# Altium project SensorControl_Board_v3.1.PrjPcb
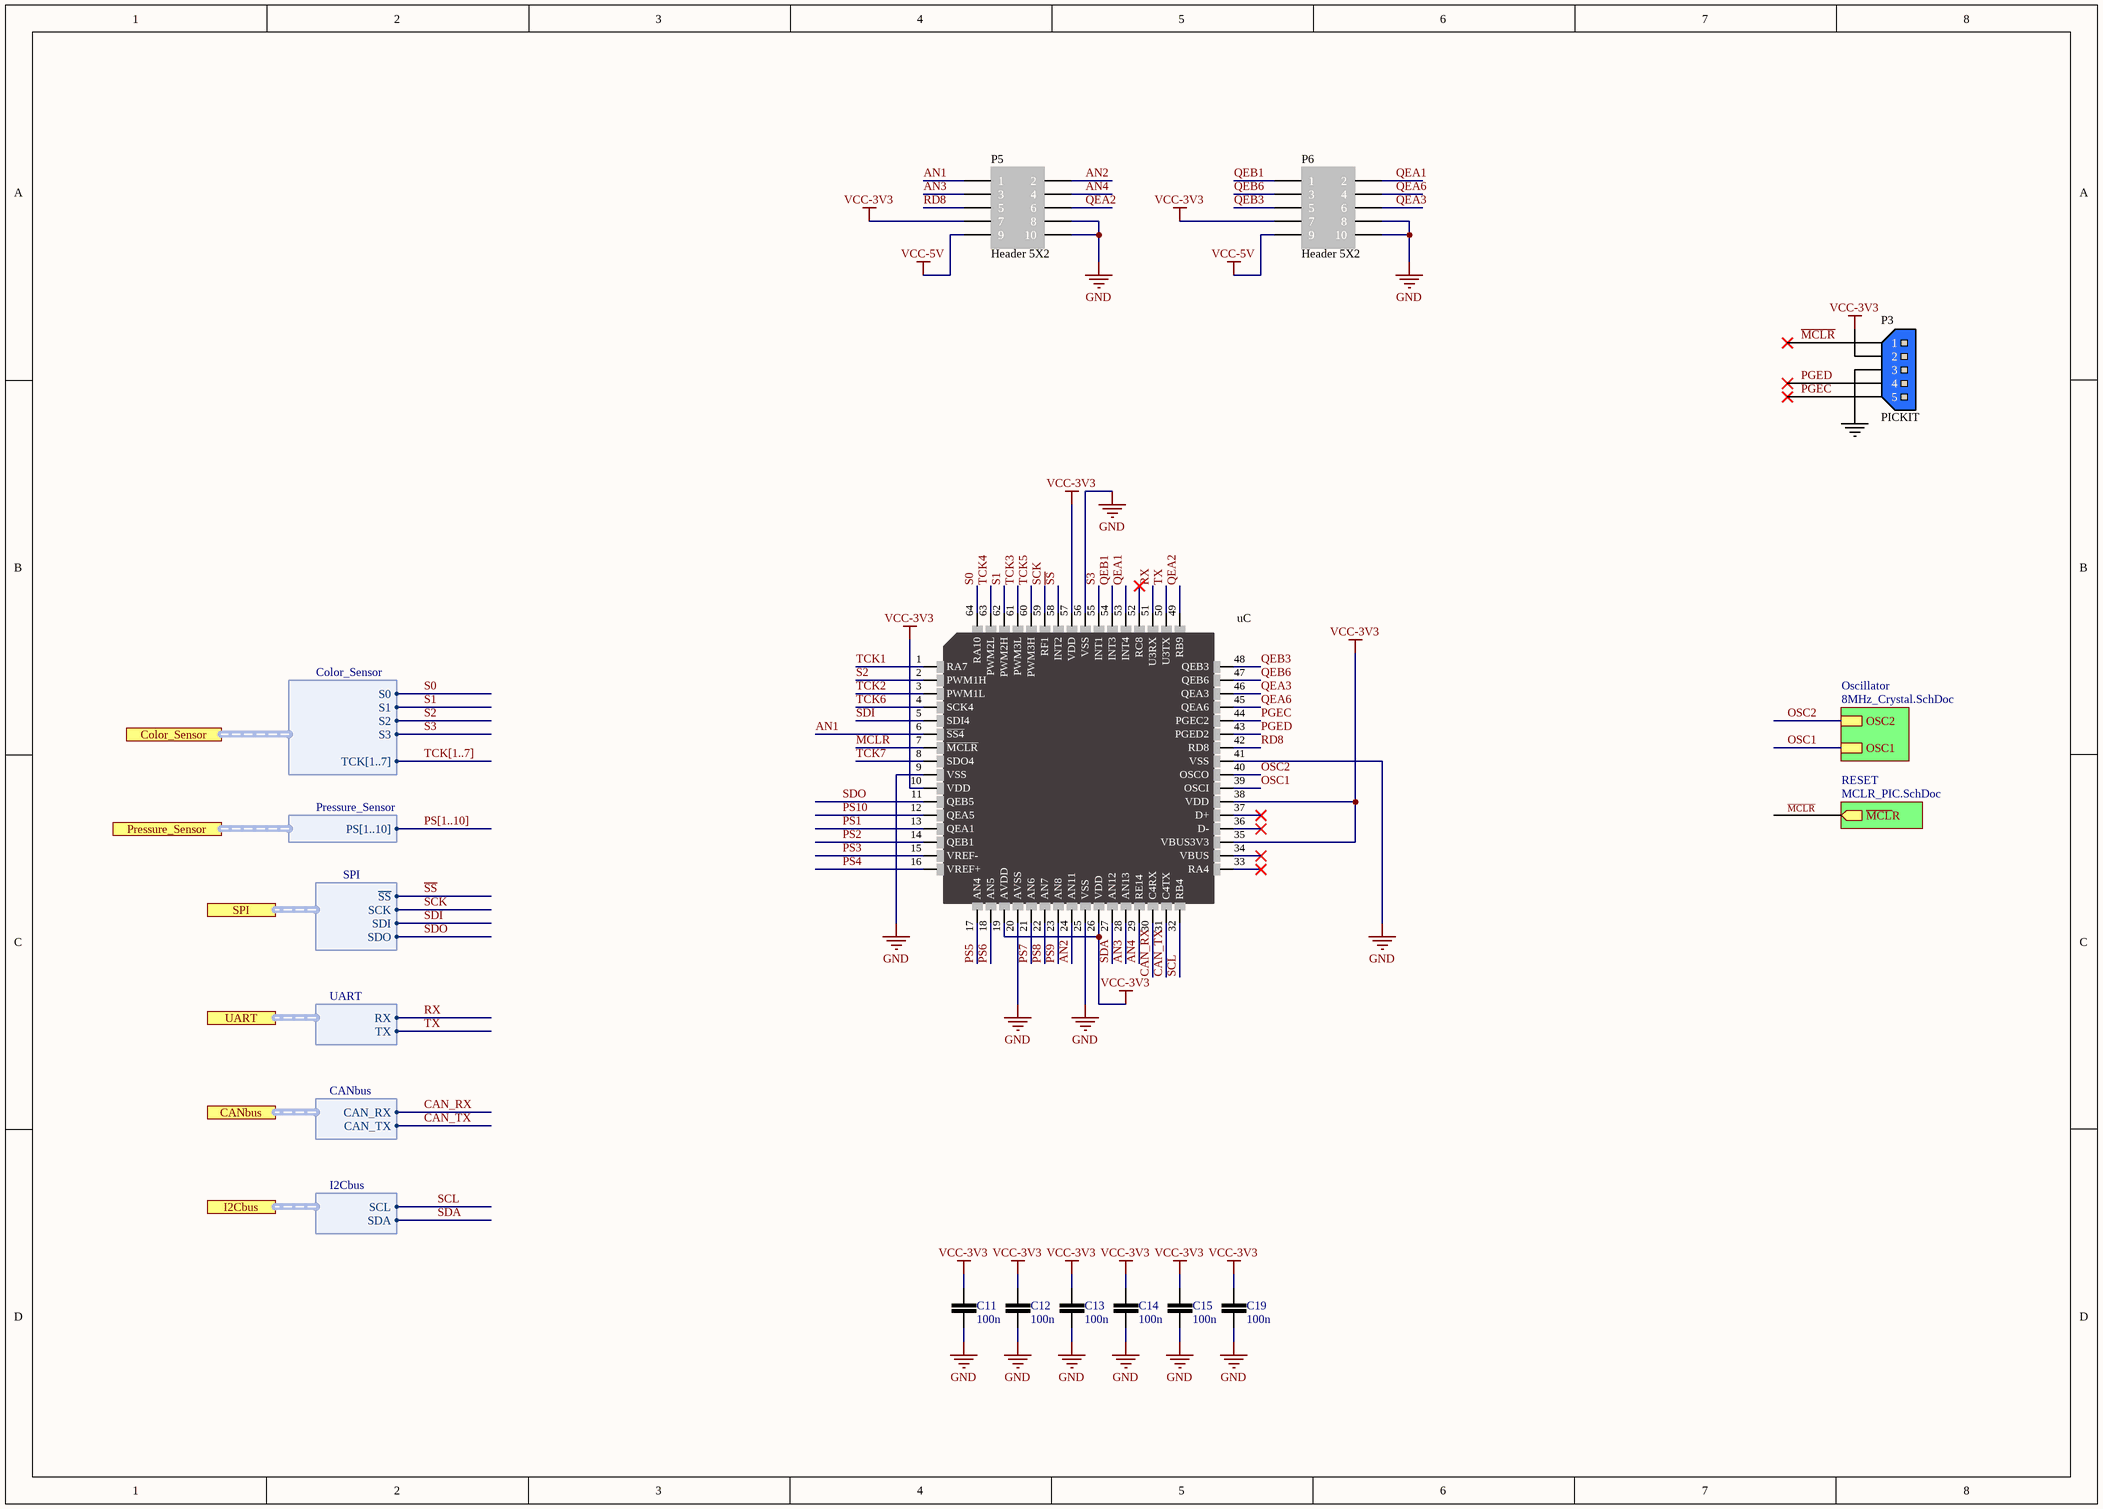
[diagram p0: PIC32MK.SchDoc]
3 sheets, 60 parts. Net scope: hierarchical (ports join the sheet entries above them; power ports are global).
Board file: SensorControl_Board_v3.1.PcbDoc
Sheets:
  PIC32MK.SchDoc
  Sensors.SchDoc
    Pressure_Sensor1 = Pressure_Sensor.SchDoc
    Pressure_Sensor2 = Pressure_Sensor.SchDoc
    Pressure_Sensor3 = Pressure_Sensor.SchDoc
    Pressure_Sensor4 = Pressure_Sensor.SchDoc
    Pressure_Sensor5 = Pressure_Sensor.SchDoc
    Pressure_Sensor6 = Pressure_Sensor.SchDoc
    Pressure_Sensor7 = Pressure_Sensor.SchDoc
    Pressure_Sensor8 = Pressure_Sensor.SchDoc
    Pressure_Sensor9 = Pressure_Sensor.SchDoc
    Pressure_Sensor10 = Pressure_Sensor.SchDoc

## Sheet PIC32MK.SchDoc
size A3

### Parts
C11  100n  [CER_0805]
C12  100n  [CER_0805]
C13  100n  [CER_0805]
C14  100n  [CER_0805]
C15  100n  [CER_0805]
C19  100n  [CER_0805]
P3  PICKIT  [TE CONNECTIVITY_5PIN_MALE]
P5  Header 5X2  [CONNECTOR_2X5]
P6  Header 5X2  [CONNECTOR_2X5]
uC  (no value)  [TQFP-64-500um]

### Sub-sheets
Oscillator = 8MHz_Crystal.SchDoc (file not in this document): OSC1, OSC2
RESET = MCLR_PIC.SchDoc (file not in this document): ~{MCL}R (out)

### Ports
CANbus (harness CANbus), Color_Sensor (harness Color_Sensor), I2Cbus (harness I2Cbus), Pressure_Sensor (harness Pressure_Sensor), SPI (harness SPI), UART (harness UART)

### Harnesses
Color_Sensor: TCK[1..7], S0, S1, S2, S3
Pressure_Sensor: PS[1..10]
SPI: ~{SS}, SCK, SDI, SDO
UART: RX, TX
CANbus: CAN_RX, CAN_TX
I2Cbus: SCL, SDA

### Nets
GND: C11.1 C12.1 C13.1 C14.1 C15.1 C19.1 P3.3 P5.8 P5.10 P6.8 P6.10 uC.9(VSS) uC.20(AVSS) uC.25(VSS) uC.41(VSS) uC.56(VSS)
VCC-3V3: C11.2 C12.2 C13.2 C14.2 C15.2 C19.2 P3.2 P5.7 P6.7 uC.10(VDD) uC.19(AVDD) uC.26(VDD) uC.35(VBUS3V3) uC.38(VDD) uC.57(VDD)
VCC-5V: P5.9 P6.9
AN1: P5.1 uC.6(~{SS4})
AN2: P5.2 uC.24(AN11)
AN3: P5.3 uC.28(AN13)
AN4: P5.4 uC.29(RE14)
CAN_RX: uC.30(C4RX) ; port CANbus.CAN_RX
CAN_TX: uC.31(C4TX) ; port CANbus.CAN_TX
~{MCLR}: P3.1 uC.7(~{MCLR}) ; sheet RESET/~{MCL}R
OSC1: uC.39(OSCI) ; sheet Oscillator/OSC1
OSC2: uC.40(OSCO) ; sheet Oscillator/OSC2
PGEC: P3.5 uC.44(PGEC2)
PGED: P3.4 uC.43(PGED2)
PS1: uC.13(QEA1)
PS2: uC.14(QEB1)
PS3: uC.15(VREF-)
PS4: uC.16(VREF+)
PS5: uC.17(AN4)
PS6: uC.18(AN5)
PS7: uC.21(AN6)
PS8: uC.22(AN7)
PS9: uC.23(AN8)
PS10: uC.12(QEA5)
QEA1: P6.2 uC.53(INT4)
QEA2: P5.6 uC.49(RB9)
QEA3: P6.6 uC.46(QEA3)
QEA6: P6.4 uC.45(QEA6)
QEB1: P6.1 uC.54(INT3)
QEB3: P6.5 uC.48(QEB3)
QEB6: P6.3 uC.47(QEB6)
RD8: P5.5 uC.42(RD8)
RX: uC.51(U3RX) ; port UART.RX
S0: uC.64(RA10) ; port Color_Sensor.S0
S1: uC.62(PWM2H) ; port Color_Sensor.S1
S2: uC.2(PWM1H) ; port Color_Sensor.S2
S3: uC.55(INT1) ; port Color_Sensor.S3
~{SS}: uC.58(INT2) ; port SPI.~{SS}
SCK: uC.59(RF1) ; port SPI.SCK
SCL: uC.32(RB4) ; port I2Cbus.SCL
SDA: uC.27(AN12) ; port I2Cbus.SDA
SDI: uC.5(SDI4) ; port SPI.SDI
SDO: uC.11(QEB5) ; port SPI.SDO
TCK1: uC.1(RA7)
TCK2: uC.3(PWM1L)
TCK3: uC.61(PWM3L)
TCK4: uC.63(PWM2L)
TCK5: uC.60(PWM3H)
TCK6: uC.4(SCK4)
TCK7: uC.8(SDO4)
TX: uC.50(U3TX) ; port UART.TX

Not connected (* = marked no-connect by the designer): uC 33(RA4)* 34(VBUS)* 36(D-)* 37(D+)* 52(RC8)*

### Buses and harness runs
bus PS[1..10]
bus TCK[1..7]

### Library data of the parts
C11-C15 C19 = 0100000001868: Manufacturer: Yageo; Manufacturer Part Number: CC0805KRX7R9BB104; id: 136; Assembly: SMD; Temperature Coefficient: X7R; Tolerance: 10%; Voltage Rated: 50; item_id: 450; Recommended Rating: Platinum; Barcode: 0100000001868; Category: Capacitors; Capacitance: 100n; Package Case: 0805; Family: CERAMIC CAPACITOR; Part Type: Capacitors
P3 = TE CONNECTIVITY_5PIN_MALE: BLUE_5PIN_CONECTOR; Manufacturer: TE CONNECTIVITY / AMP; Manufacturer Part Number 1: 281695-3; Order Code 1: 1205983; Price 1: £0.403; Supplier 1: uk.farnell.com
P5 P6 = Header 5X2: Header, 5-Pin, Dual row; LatestRevisionDate: 17-Jul-2002; LatestRevisionNote: Re-released for DXP Platform.; Publisher: Altium Limited
uC = PIC32MK1024MCF064: IC MCU 32BIT 1MB FLASH 64TQFP; Manufacturer Part Number: PIC32MK1024MCF064

## Sheet Sensors.SchDoc
size A4
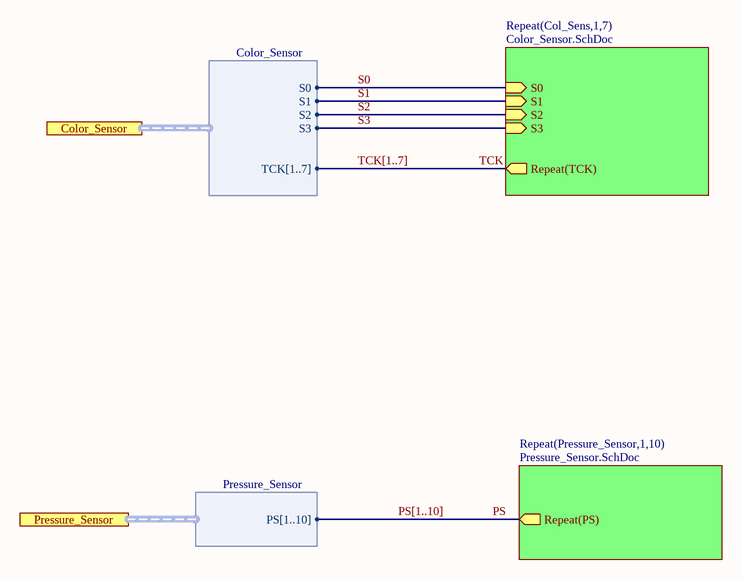
[diagram p1: Sensors.SchDoc]

### Sub-sheets
Repeat(Col_Sens,1,7) = Color_Sensor.SchDoc (file not in this document): S0 (in), S1 (in), S2 (in), S3 (in), Repeat(TCK) (out)
Repeat(Pressure_Sensor,1,10) = Pressure_Sensor.SchDoc: Repeat(PS) (out)

### Ports
Color_Sensor (harness Color_Sensor), Pressure_Sensor (harness Pressure_Sensor)

### Harnesses
Color_Sensor: TCK[1..7], S0, S1, S2, S3
Pressure_Sensor: PS[1..10]

### Nets
PS: sheet Repeat(Pressure_Sensor,1,10)/Repeat(PS)
S0: sheet Repeat(Col_Sens,1,7)/S0, port Color_Sensor.S0
S1: sheet Repeat(Col_Sens,1,7)/S1, port Color_Sensor.S1
S2: sheet Repeat(Col_Sens,1,7)/S2, port Color_Sensor.S2
S3: sheet Repeat(Col_Sens,1,7)/S3, port Color_Sensor.S3
TCK: sheet Repeat(Col_Sens,1,7)/Repeat(TCK)

### Buses and harness runs
bus PS[1..10]
bus TCK[1..7]

## Sheet Pressure_Sensor.SchDoc
size A4
Used 10 times, as channels Pressure_Sensor1, Pressure_Sensor2, Pressure_Sensor3, Pressure_Sensor4, Pressure_Sensor5, Pressure_Sensor6, Pressure_Sensor7, Pressure_Sensor8, Pressure_Sensor9, Pressure_Sensor10. Parts and nets are listed once, with the designators drawn on the sheet.
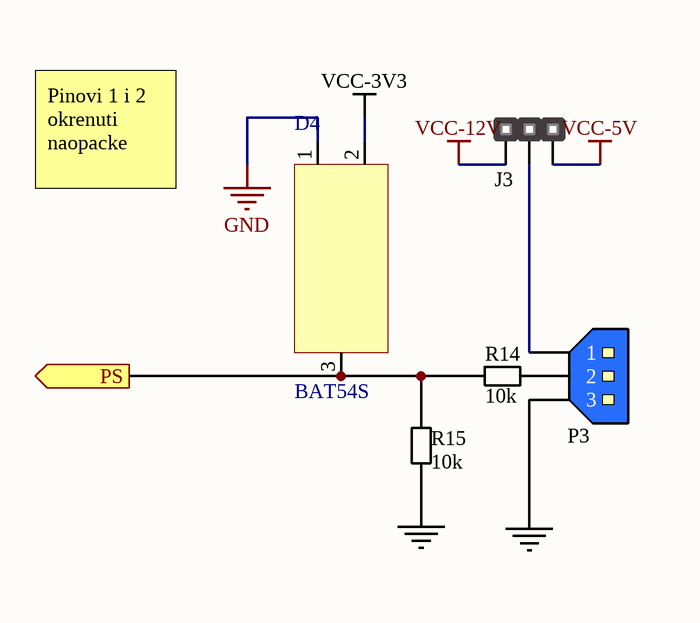
[diagram p2: Pressure_Sensor.SchDoc]

### Parts
D4  BAT54S  [BAT54S]
J3  *  [HM1X3]  (value not drawn)
P3  TE CONNECTIVITY_3PIN_MALE  [TE CONNECTIVITY_3PIN_MALE]  (value not drawn)
R14  10k  [RESC2013X38N-0805-NOOVERLAY]
R15  10k  [RESC2013X38N-0805-NOOVERLAY]

### Ports
PS (out)

### Nets
GND: P3.3 R15.1
VCC-5V: J3.3
VCC-12V: J3.1
PS: D4.3 R14.2 R15.2 ; port PS
NetJ3_2: J3.2 P3.1
NetP3_2: P3.2 R14.1

Not connected (* = marked no-connect by the designer): D4 1 2

### Channels
Pressure_Sensor1: designators end in _Pressure_Sensor1; ports PS=PS1
Pressure_Sensor2: designators end in _Pressure_Sensor2; ports PS=PS2
Pressure_Sensor3: designators end in _Pressure_Sensor3; ports PS=PS3
Pressure_Sensor4: designators end in _Pressure_Sensor4; ports PS=PS4
Pressure_Sensor5: designators end in _Pressure_Sensor5; ports PS=PS5
Pressure_Sensor6: designators end in _Pressure_Sensor6; ports PS=PS6
Pressure_Sensor7: designators end in _Pressure_Sensor7; ports PS=PS7
Pressure_Sensor8: designators end in _Pressure_Sensor8; ports PS=PS8
Pressure_Sensor9: designators end in _Pressure_Sensor9; ports PS=PS9
Pressure_Sensor10: designators end in _Pressure_Sensor10; ports PS=PS10

### Notes on the sheet
- Pinovi 1 i 2 okrenuti naopacke

### Library data of the parts
J3 = HEADER_1x3: Manufacturer Part Number: *
P3 = TE CONNECTIVITY_3PIN_MALE: BLUE_3PIN_CONECTOR; Manufacturer: TE CONNECTIVITY / AMP; Manufacturer Part Number 1: 281695-3; Order Code 1: 1205983; Price 1: £0.403; Supplier 1: uk.farnell.com
R14 R15 = 000001002: RES SMD 10 kOhm 1/8W 0805; Resistance: 10k

## Nets that join several sheets
GND: PIC32MK (16 pins), Pressure_Sensor1 (P3_Pressure_Sensor1.3 R15_Pressure_Sensor1.1), Pressure_Sensor2 (P3_Pressure_Sensor2.3 R15_Pressure_Sensor2.1), Pressure_Sensor3 (P3_Pressure_Sensor3.3 R15_Pressure_Sensor3.1), Pressure_Sensor4 (P3_Pressure_Sensor4.3 R15_Pressure_Sensor4.1), Pressure_Sensor5 (P3_Pressure_Sensor5.3 R15_Pressure_Sensor5.1), Pressure_Sensor6 (P3_Pressure_Sensor6.3 R15_Pressure_Sensor6.1), Pressure_Sensor7 (P3_Pressure_Sensor7.3 R15_Pressure_Sensor7.1), Pressure_Sensor8 (P3_Pressure_Sensor8.3 R15_Pressure_Sensor8.1), Pressure_Sensor9 (P3_Pressure_Sensor9.3 R15_Pressure_Sensor9.1), Pressure_Sensor10 (P3_Pressure_Sensor10.3 R15_Pressure_Sensor10.1)
VCC-5V: PIC32MK (P5.9 P6.9), Pressure_Sensor1 (J3_Pressure_Sensor1.3), Pressure_Sensor2 (J3_Pressure_Sensor2.3), Pressure_Sensor3 (J3_Pressure_Sensor3.3), Pressure_Sensor4 (J3_Pressure_Sensor4.3), Pressure_Sensor5 (J3_Pressure_Sensor5.3), Pressure_Sensor6 (J3_Pressure_Sensor6.3), Pressure_Sensor7 (J3_Pressure_Sensor7.3), Pressure_Sensor8 (J3_Pressure_Sensor8.3), Pressure_Sensor9 (J3_Pressure_Sensor9.3), Pressure_Sensor10 (J3_Pressure_Sensor10.3)
VCC-12V: Pressure_Sensor1 (J3_Pressure_Sensor1.1), Pressure_Sensor2 (J3_Pressure_Sensor2.1), Pressure_Sensor3 (J3_Pressure_Sensor3.1), Pressure_Sensor4 (J3_Pressure_Sensor4.1), Pressure_Sensor5 (J3_Pressure_Sensor5.1), Pressure_Sensor6 (J3_Pressure_Sensor6.1), Pressure_Sensor7 (J3_Pressure_Sensor7.1), Pressure_Sensor8 (J3_Pressure_Sensor8.1), Pressure_Sensor9 (J3_Pressure_Sensor9.1), Pressure_Sensor10 (J3_Pressure_Sensor10.1)